# EAGLE design XX-Piezo-Reciever (EAGLE 8.3.2)
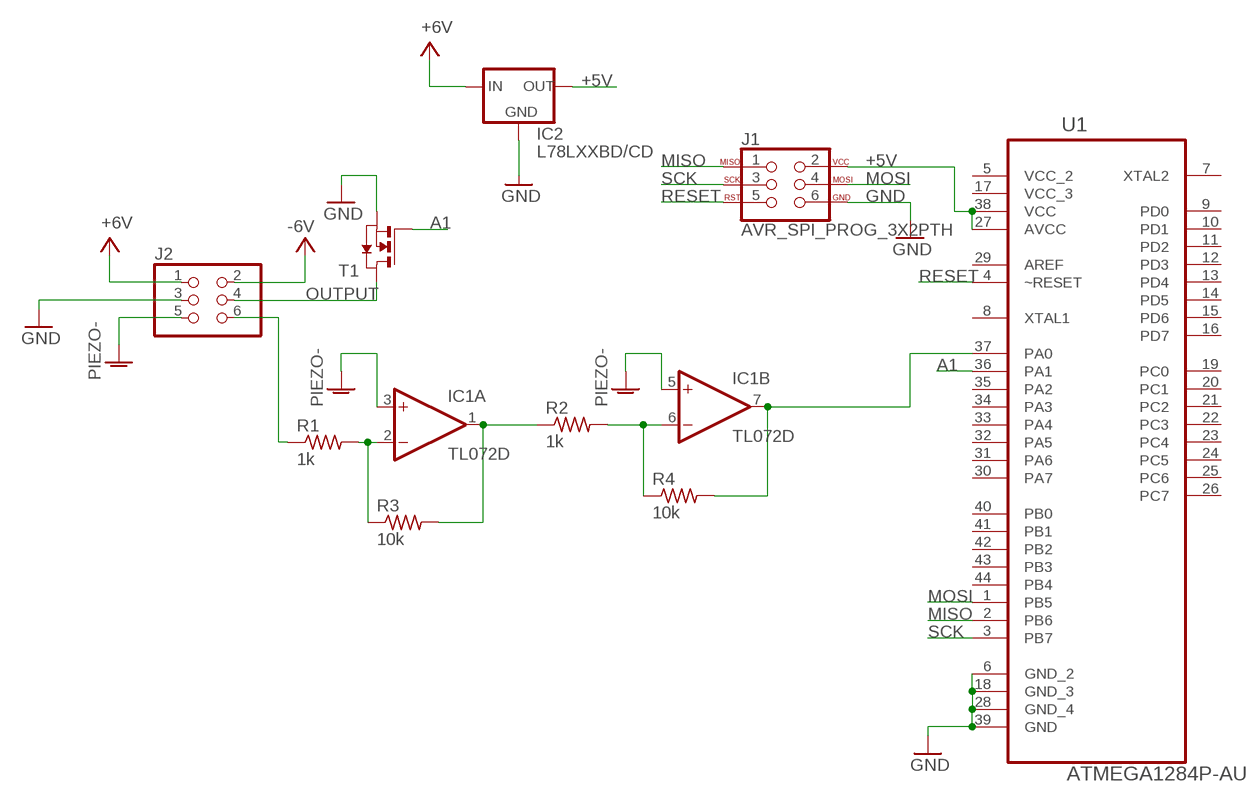
[diagram p0: schematic, sheet 1]

## Parts
IC1  TL072D  [SO08]
IC2  L78LXXBD/CD  [SO08]
J1  AVR_SPI_PROG_3X2PTH  [2X3]
J2  PINHD-2X3  [2X03]
R1  1k  R-US_R0402  [R0402]
R2  1k  R-US_R0402  [R0402]
R3  10k  R-US_R0402  [R0402]
R4  10k  R-US_R0402  [R0402]
T1  NMOSSOT23  [SOT-23]
U1  ATMEGA1284P-AU  [QFP80P1200X1200X120-44N]

## Nets
+5V: IC2.1(OUT) J1.2 U1.27(AVCC) U1.38(VCC)
+6V: IC2.8(IN) J2.1
-6V: J2.2
A1: T1.3(G) U1.36(PA1)
GND: IC2.2(GND1) J1.6 J2.3 T1.2(S) U1.6(GND_2) U1.18(GND_3) U1.28(GND_4) U1.39(GND)
MISO: J1.1 U1.2(PB6)
MOSI: J1.4 U1.1(PB5)
OUT1: IC1.1(A:OUT) R2.1 R3.2
OUT2: IC1.7(B:OUT) R4.2 U1.37(PA0)
OUTPUT: J2.4 T1.1(D)
PIEZO+: J2.6 R1.1
PIEZO+1: IC1.2(A:-IN) R1.2 R3.1
PIEZO+2: IC1.6(B:-IN) R2.2 R4.1
PIEZO-: IC1.3(A:+IN) IC1.5(B:+IN) J2.5
RESET: J1.5 U1.4(~RESET)
SCK: J1.3 U1.3(PB7)
Unconnected: IC2.3(GND3) IC2.6(GND4) IC2.7(GND2) U1.7(XTAL2) U1.8(XTAL1) U1.9(PD0) U1.10(PD1) U1.11(PD2) U1.12(PD3) U1.13(PD4) U1.14(PD5) U1.15(PD6) U1.16(PD7) U1.19(PC0) U1.20(PC1) U1.21(PC2) U1.22(PC3) U1.23(PC4) U1.24(PC5) U1.25(PC6) U1.26(PC7) U1.29(AREF) U1.30(PA7) U1.31(PA6) U1.32(PA5) U1.33(PA4) U1.34(PA3) U1.35(PA2) U1.40(PB0) U1.41(PB1) U1.42(PB2) U1.43(PB3) U1.44(PB4)

## Power pins joined to a net without a drawn wire
+6V: IC1.8(P:V+)
-6V: IC1.4(P:V-)
VCC_2: U1.5(VCC_2)
VCC_3: U1.17(VCC_3)

## Library data of the parts
IC1 = linear3:TL072: OP AMP
IC2 = v-reg-3:L78LXXBD/CD: VOLTAGE REGULATOR
J1 = SparkFun-Connectors:AVR_SPI_PROG_3X2: AVR ISP 6 Pin This is the reduced ISP connector for AVR programming. Common on Arduino. This footprint will take up less PCB space and can be used with a 10-pin to 6-pin adapter such as SKU: BOB-08508 **Special note about "TEST_POINT" package. The stop mask is on the top side, so if you want your programming test points to be on the bottom of your board, make sure to place this package on the bottom side of the board. This also ensure that the orientation to program from the bottom side will be correct. SparkFun Products: SparkFun ISP Pogo Adapter <https://www.sparkfun.com/products/11591> - NS Tiny AVR Programmer <https://www.sparkfun.com/products/11801> -PTH
J2 = SparkFun-Retired:PINHD-2X3: PIN HEADER
R1-R4 = rcl:R-US_: RESISTOR, American symbol
T1 = zetex:NMOSSOT23: MOS FET; OC_FARNELL: unknown; OC_NEWARK: unknown
U1 = Atmel_By_element14_Batch_1-00:ATMEGA1284P-AU: Microcontroller with Programmable Flash; MPN: ATMEGA1284P-AU; OC_FARNELL: 1715480; OC_NEWARK: 15R0263; PACKAGE: TQFP-44; SUPPLIER: Atmel

## Board
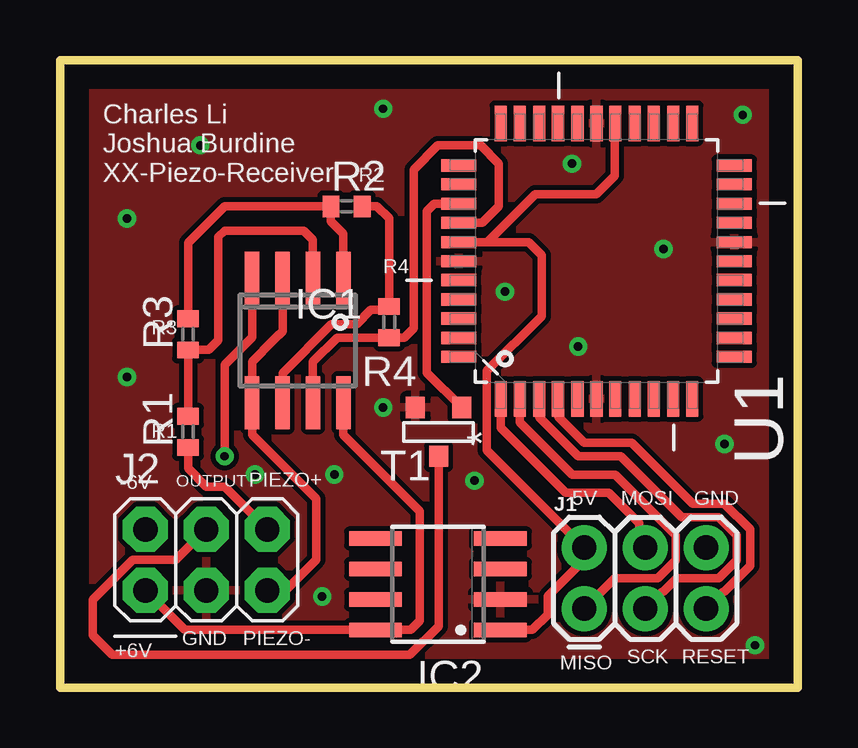
[diagram p1: board, top side]
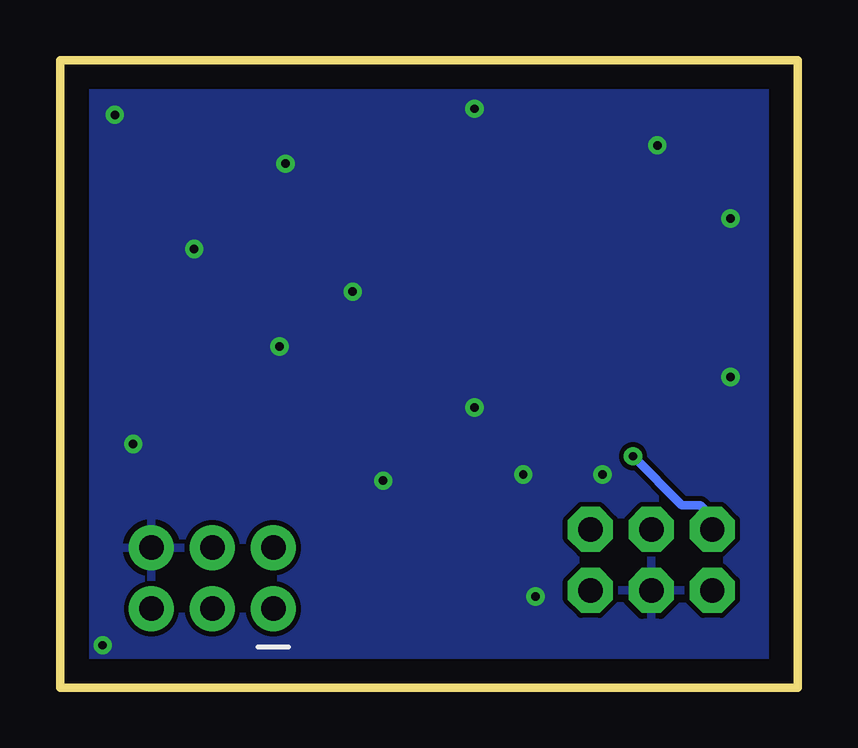
[diagram p2: board, bottom side, seen from below]

Size 30.73 x 26.16 mm. Coordinates in mm from the lower left corner, seen from the top.
Outline: 30.73,26.16 0,26.16 0,0 30.73,0 30.73,26.16
Copper layers (1*16): Top 0.035mm / dielectric 1.5mm / Bottom 0.035mm
Design rules "default *": minimum track width 6mil, minimum drill 0.35mm, track to track 8mil, track to pad 6mil, pad to pad 6mil, via to via 6mil, smd to smd 6mil, copper to edge 40mil, drill to drill 6mil, minimum pad ring 10mil, minimum via ring 8mil, stop-mask expansion 4mil, vias tented up to drill 0mil, thermal gap 10mil

### Footprints (pad centres in the part's own frame; a part is rotated, then mirrored left to right if it is on the bottom)
SO08 = smd 0.6 x 2.2: 1 -1.905,-2.6; 2 -0.635,-2.6; 3 0.635,-2.6; 4 1.905,-2.6; 5 1.905,2.6; 6 0.635,2.6; 7 -0.635,2.6; 8 -1.905,2.6
2X3 = drill 1.016 pad 1.88: 1 0,0; 2 0,2.54; 3 2.54,0; 4 2.54,2.54; 5 5.08,0; 6 5.08,2.54
2X03 = drill 1.016 pad 1.88 octagon: 1 -2.54,-1.27; 2 -2.54,1.27; 3 0,-1.27; 4 0,1.27; 5 2.54,-1.27; 6 2.54,1.27
R0402 = smd 0.7 x 0.9: 1 -0.65,0; 2 0.65,0
SOT-23 = smd 0.787 x 0.889: 1 0.025,-1.016; 2 -0.94,1.016; 3 0.991,1.016
QFP80P1200X1200X120-44N = smd 1.473 x 0.508: 1 -5.74,3.988; 2 -5.74,3.2; 3 -5.74,2.388; 4 -5.74,1.6; 5 -5.74,0.787; 6 -5.74,0; 7 -5.74,-0.787; 8 -5.74,-1.6; 9 -5.74,-2.388; 10 -5.74,-3.2; 11 -5.74,-3.988; 23 5.74,-3.988; 24 5.74,-3.2; 25 5.74,-2.388; 26 5.74,-1.6; 27 5.74,-0.787; 28 5.74,0; 29 5.74,0.787; 30 5.74,1.6; 31 5.74,2.388; 32 5.74,3.2; 33 5.74,3.988 | smd 0.508 x 1.473: 12 -3.988,-5.74; 13 -3.2,-5.74; 14 -2.388,-5.74; 15 -1.6,-5.74; 16 -0.787,-5.74; 17 0,-5.74; 18 0.787,-5.74; 19 1.6,-5.74; 20 2.388,-5.74; 21 3.2,-5.74; 22 3.988,-5.74; 34 3.988,5.74; 35 3.2,5.74; 36 2.388,5.74; 37 1.6,5.74; 38 0.787,5.74; 39 0,5.74; 40 -0.787,5.74; 41 -1.6,5.74; 42 -2.388,5.74; 43 -3.2,5.74; 44 -3.988,5.74

### Placement (x,y rotation side)
IC1  9.91,14.48 180 top
IC2  15.75,4.32 90 top
J1  21.84,3.3 0 top
J2  6.1,5.33 0 top
R1  5.33,10.67 90 top
R2  11.94,20.07 0 top
R3  5.33,14.73 90 top
R4  13.72,15.24 270 top
T1  15.75,10.67 0 top
U1  22.35,17.78 90 top

### Tracks (layer width: path | path; a pad name or v marks a point on that pad's centre or on a via)
+5V
  Top 0.356: IC2.1 19.68,2.41 20.32,3.05 20.32,3.81 21.84,5.33 J1.2 17.78,9.91 17.78,13.21 20.07,15.49 20.07,18.03 19.53,18.57 U1.38 | 17.75,18.57 U1.38 | U1.38 17.8,18.57 19.81,20.57 22.35,20.57 23.11,21.34 23.11,23.5 U1.27
+6V
  Top 0.356: J2.1 5.21,2.41 IC2.8 14.61,2.41 14.99,2.79 14.99,7.37 11.81,10.54 IC1.8
-6V  (via drill 0.35)
  Top 0.356: IC1.4 8,14.61 6.86,13.46 v6.86,9.65
  Bottom 0.356: v6.86,9.65 4.83,7.62 4.06,7.62 3.56,7.11 J2.2
A1
  Top 0.356: U1.36 15.6,20.17 15.29,19.86 15.29,13.13 T1.3
GND  (via drill 0.35)
  other vias: 8.13,8.89 10.92,3.81 13.46,11.68 2.79,19.56 27.69,10.16 28.96,1.78 17.27,8.64 11.43,8.89 28.45,23.88 5.84,22.61 21.34,21.84 18.54,16.51 13.46,24.13 25.15,18.29 2.79,12.95 21.59,14.22
  pour Top: 0,26.16 0,0 30.73,0 30.73,26.16
  pour Bottom: 0,0 30.73,0 30.73,26.16 0,26.16
MISO
  Top 0.356: U1.2 19.15,11.07 21.34,8.89 23.13,8.89 25.65,6.37 25.65,5.32 24.91,4.57 23.11,4.57 J1.1
MOSI
  Top 0.356: U1.1 18.36,10.85 21.08,8.13 22.86,8.13 24.13,6.86 24.13,6.1 J1.4
OUT1
  Top 0.356: IC1.1 11.81,18.92 11.29,19.45 R2.1 6.86,20.07 5.33,18.54 R3.2
OUT2
  Top 0.356: U1.37 17.6,19.38 18.29,20.07 18.29,21.84 17.53,22.61 15.75,22.61 14.73,21.59 14.73,14.99 14.34,14.59 R4.2 11.54,14.59 10.54,13.59 IC1.7
OUTPUT
  Top 0.356: T1.1 15.77,2.56 14.58,1.37 2.18,1.37 1.37,2.18 1.37,3.68 3.03,5.33 4.83,5.33 J2.4
PIEZO+
  Top 0.356: R1.1 5.33,9.14 6.1,8.38 6.86,8.38 J2.6
PIEZO+1
  Top 0.356: IC1.2 10.54,18.67 10.16,19.05 6.86,19.05 6.6,18.8 6.6,14.48 6.21,14.08 R3.1 R1.2
PIEZO+2
  Top 0.356: IC1.6 9.27,13.11 11.31,15.15 12.36,15.15 12.95,15.75 13.57,15.75 R4.1 13.72,19.56 13.21,20.07 R2.2
PIEZO-
  Top 0.356: J2.5 9.4,4.06 10.67,5.33 10.67,7.87 8,10.54 IC1.5 8,13.59 8.89,14.48 | 8.89,14.48 9.14,14.73 | IC1.3 9.27,14.86 8.89,14.48
RESET
  Top 0.356: U1.4 20.75,11.3 21.84,10.21 23.82,10.21 26.36,7.67 27.68,7.67 28.75,6.6 28.75,5.08 27.68,4.01 27.64,4.01 J1.5
SCK
  Top 0.356: U1.3 19.96,11.28 21.59,9.65 23.37,9.65 25.91,7.11 27.45,7.11 28.19,6.37 28.19,5.32 27.45,4.57 25.7,4.57 25.14,4.01 25.09,4.01 J1.3

### Text on the board
tPlace: Charles Li / Joshua Burdine / XX-Piezo-Receiver | R2 | R4 | R3 | R1 | -6V | OUTPUT | PIEZO+ | 5V | MOSI | GND | GND | PIEZO- | +6V | MISO | SCK | RESET